# EAGLE design rapidshark-display-shifter-mk-1.1 (EAGLE 6.5.0)
AUTHOR: sean@yak.net
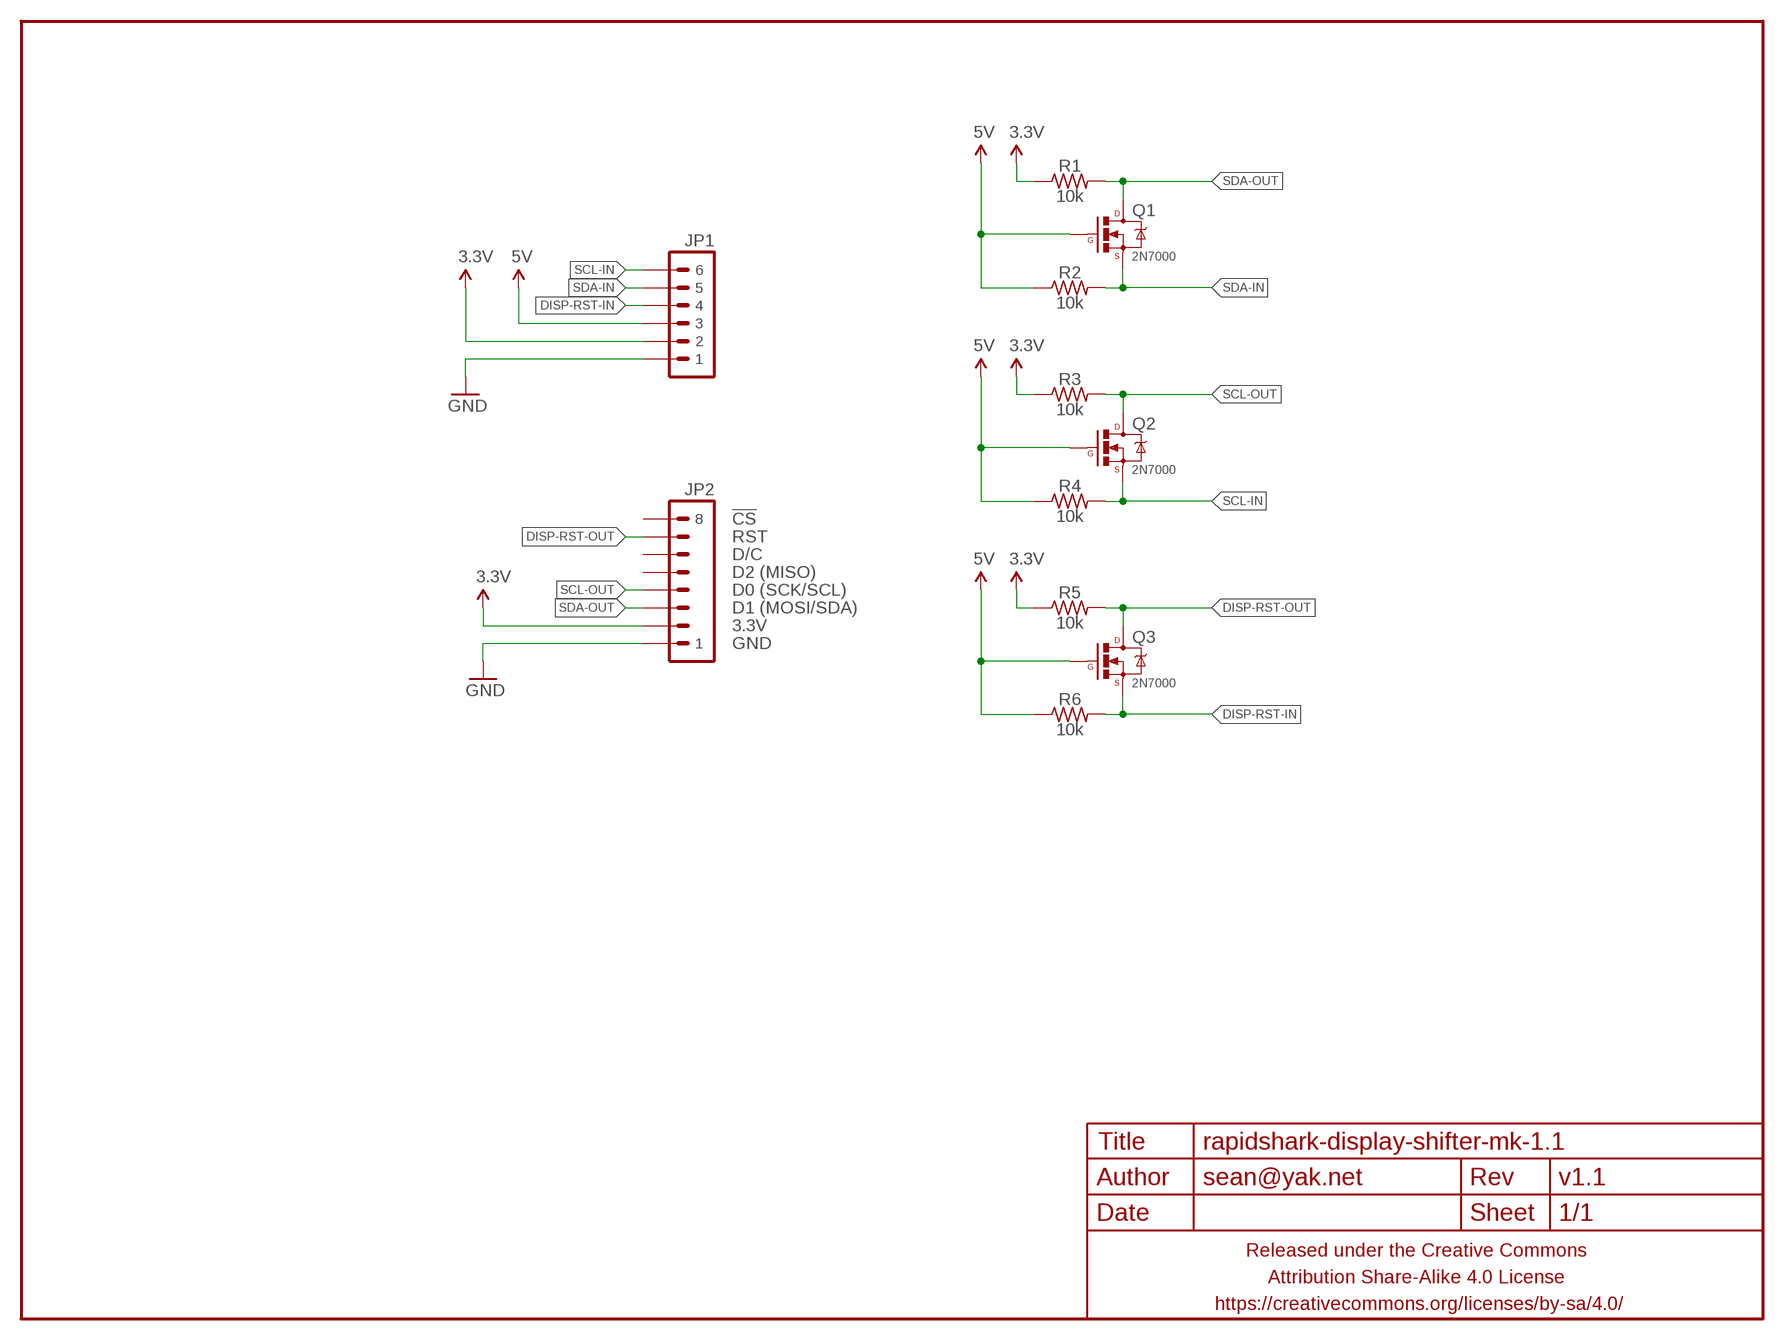
[diagram p0: schematic, sheet 1]

## Parts
FRAME1  FRAME-LETTERNO_PACKAGE  [DUMMY]
JP1  M06JST-PH-PTH-VERT  [JST-6-PH-VERT-PTH]
JP2  M081X08  [1X08]
Q1  2N7000  MOSFET-NCHANNEL2N7000-AMMO  [TO-92-AMMO]
Q2  2N7000  MOSFET-NCHANNEL2N7000-AMMO  [TO-92-AMMO]
Q3  2N7000  MOSFET-NCHANNEL2N7000-AMMO  [TO-92-AMMO]
R1  10k  RESISTORPTH-AXIAL-5.08MM  [RESISTOR-AXIAL-PTH-5.08MM]
R2  10k  RESISTORPTH-AXIAL-5.08MM  [RESISTOR-AXIAL-PTH-5.08MM]
R3  10k  RESISTORPTH-AXIAL-5.08MM  [RESISTOR-AXIAL-PTH-5.08MM]
R4  10k  RESISTORPTH-AXIAL-5.08MM  [RESISTOR-AXIAL-PTH-5.08MM]
R5  10k  RESISTORPTH-AXIAL-5.08MM  [RESISTOR-AXIAL-PTH-5.08MM]
R6  10k  RESISTORPTH-AXIAL-5.08MM  [RESISTOR-AXIAL-PTH-5.08MM]

## Nets
3.3V: JP1.2 JP2.2 R1.P$1 R3.P$1 R5.P$1
5V: JP1.3 Q1.2(G) Q2.2(G) Q3.2(G) R2.P$1 R4.P$1 R6.P$1
DISP-RST-IN: JP1.4 Q3.1(S) R6.P$2
DISP-RST-OUT: JP2.7 Q3.3(D) R5.P$2
GND: JP1.1 JP2.1
SCL-IN: JP1.6 Q2.1(S) R4.P$2
SCL-OUT: JP2.4 Q2.3(D) R3.P$2
SDA-IN: JP1.5 Q1.1(S) R2.P$2
SDA-OUT: JP2.3 Q1.3(D) R1.P$2
Unconnected: JP2.5 JP2.6 JP2.8

## Notes on the sheet
- !CS
- RST
- D/C
- D2 (MISO)
- D0 (SCK/SCL)
- D1 (MOSI/SDA)
- 3.3V
- GND

## Library data of the parts
FRAME1 = A_butts:FRAME-LETTER: Schematic Frame Standard 8.5x11 US Letter frame; DESIGNER: sean@yak.net; VERSION: v1.1
JP1 = A_butts:M06: Header 6 Standard 6-pin 0.1" header. Use with straight break away headers (SKU : PRT-00116), right angle break away headers (PRT-00553), swiss pins (PRT-00743), machine pins (PRT-00117), and female headers (PRT-00115). Molex polarized connector foot print use with SKU : PRT-08094 with associated crimp pins and housings. NOTES ON THE VARIANTS LOCK and LOCK_LONGPADS... This footprint was designed to help hold the alignment of a through-hole component (i.e. 6-pin header) while soldering it into place. You may notice that each hole has been shifted either up or down by 0.005 of an inch from it's more standard position (which is a perfectly straight line). This slight alteration caused the pins (the squares in the middle) to touch the edges of the holes. Because they are alternating, it causes a "brace" to hold the component in place. 0.005 has proven to be the perfect amount of "off-center" position when using our standard breakaway headers. Although looks a little odd when you look at the bare footprint, once you have a header in there, the alteration is very hard to notice. Also,if you push a header all the way into place, it is covered up entirely on the bottom side. This idea of altering the position of holes to aid alignment will be further integrated into the Sparkfun Library for other footprints. It can help hold any component with 3 or more connection pins.
JP2 = A_butts:M08: Header 8 Standard 8-pin 0.1" header. Use with straight break away headers (SKU : PRT-00116), right angle break away headers (PRT-00553), swiss pins (PRT-00743), machine pins (PRT-00117), and female headers (PRT-00115).
Q1-Q3 = A_butts:MOSFET-NCHANNEL: Common NMOSFET Parts MFG P/N Store ID Prod ID FDD8780 TRANS-09984 SI7820DN TRANS-11055 FDS6630A IC-08089 2N7002PW TRANS-11151 FQP30N06L COM-10213 TRANS-10060 BSS123LT1G TRANS-08345 BSS138 TRANS-00830 BS170 2N7000
R1-R6 = A_butts:RESISTOR: RESISTOR, American symbol

## Board
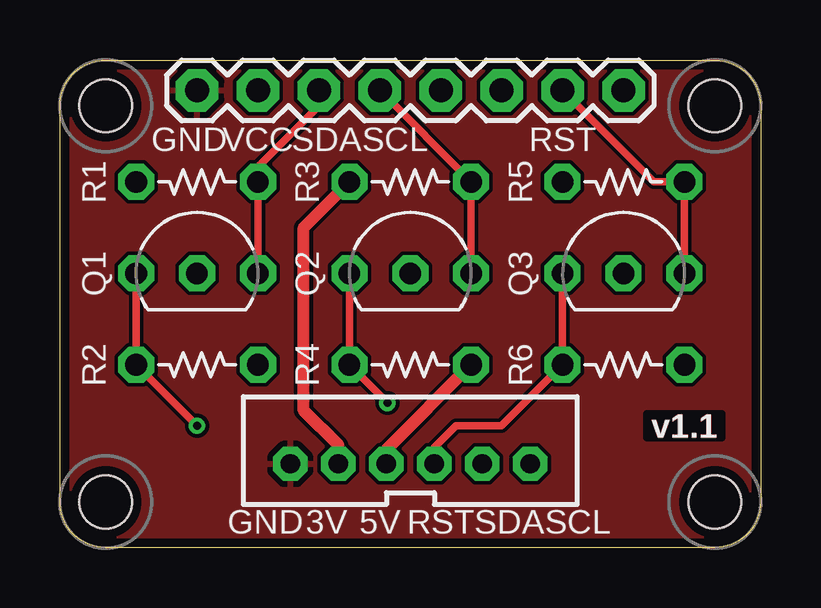
[diagram p1: board, top side]
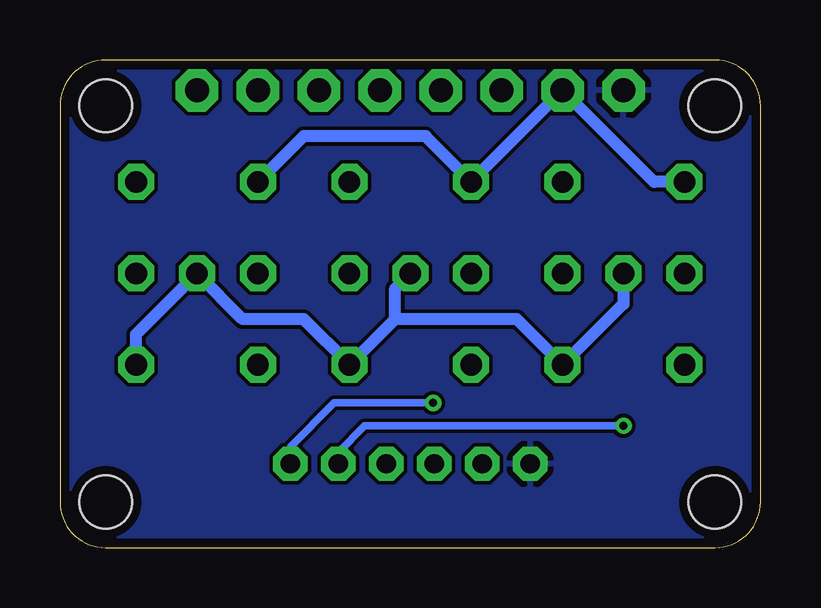
[diagram p2: board, bottom side, seen from below]

Size 29.21 x 20.32 mm. Coordinates in mm from the lower left corner, seen from the top.
Outline: 29.21,18.41 29.21,1.91 arc-90 27.3,0 1.91,0 arc-90 0,1.91 0,18.41 arc-90 1.91,20.32 27.3,20.32 arc-90 29.21,18.41
Copper layers (1*16): Top 0.0356mm / dielectric 1.5011mm / Bottom 0.0356mm
Design rules "LaenPCBOrder_2": minimum track width 6mil, minimum drill 13mil, track to track 6mil, track to pad 6mil, pad to pad 6mil, via to via 6mil, smd to smd 6mil, copper to edge 15mil, drill to drill 6mil, minimum pad ring 7mil, minimum via ring 7mil, stop-mask expansion 3mil, vias tented up to drill 20mil, thermal gap 10mil
Holes 2.2 mm at 1.91,18.41 27.3,18.41 27.3,1.91 1.91,1.91

### Footprints (pad centres in the part's own frame; a part is rotated, then mirrored left to right if it is on the bottom)
JST-6-PH-VERT-PTH = drill 0.8 pad 1.422 octagon: 1 -5,0; 2 -3,0; 3 -1,0; 4 1,0; 5 3,0; 6 5,0
1X08 = drill 1 pad 1.778 octagon: 1 0,0; 2 2.54,0; 3 5.08,0; 4 7.62,0; 5 10.16,0; 6 12.7,0; 7 15.24,0; 8 17.78,0
TO-92-AMMO = drill 0.9 pad 1.5 octagon: 1 -2.54,0; 2 0,0; 3 2.54,0
RESISTOR-AXIAL-PTH-5.08MM = drill 0.9 pad 1.5 octagon: P$1 -2.54,0; P$2 2.54,0

### Placement (x,y rotation side)
FRAME1  0,0 270 bottom
JP1  14.61,3.49 0 top
JP2  5.71,19.05 0 top
Q1  5.71,11.43 0 top
Q2  14.61,11.43 0 top
Q3  23.5,11.43 0 top
R1  5.71,15.24 0 top
R2  5.71,7.62 180 top
R3  14.61,15.24 0 top
R4  14.61,7.62 180 top
R5  23.5,15.24 0 top
R6  23.5,7.62 180 top

### Tracks (layer width: path | path; a pad name or v marks a point on that pad's centre or on a via)
3.3V
  Top 0.508: JP1.2 11.61,4.27 10.16,5.71 10.16,13.34 R3.P$1
  Bottom 0.508: R1.P$1 4.45,15.24 JP2.2 R3.P$1 13.97,17.14 19.05,17.14 R5.P$1
5V
  Top 0.508: JP1.3 13.61,4.08 R4.P$1
  Bottom 0.508: 15.24,9.53 10.16,9.53 R2.P$1 5.71,10.16 Q1.2 | 15.24,9.53 R4.P$1 19.05,9.53 21.59,9.53 Q3.2 26.04,8.89 R6.P$1 | 15.24,9.53 15.24,10.79 Q2.2
DISP-RST-IN
  Top 0.305: JP1.4 15.61,4.17 16.51,5.08 18.41,5.08 R6.P$2 Q3.1
DISP-RST-OUT
  Top 0.305: JP2.7 24.77,15.24 R5.P$2 Q3.3
GND
  pour Top (rank 6): 29.21,18.41 29.21,1.91 arc-90 27.3,0 1.91,0 arc-90 0,1.91 0,18.41 arc-90 1.91,20.32 27.3,20.32 arc-90
  pour Bottom (rank 6): 29.21,18.41 29.21,1.91 arc-90 27.3,0 1.91,0 arc-90 0,1.91 0,18.41 arc-90 1.91,20.32 27.3,20.32 arc-90
SCL-IN  (via drill 0.33)
  Top 0.305: v13.65,6.03 R4.P$2 Q2.1
  Bottom 0.305: JP1.6 19.61,4.21 17.78,6.03 v13.65,6.03
SCL-OUT
  Top 0.305: Q2.3 R3.P$2 JP2.4
SDA-IN  (via drill 0.33)
  Top 0.305: v5.71,5.08 R2.P$2 Q1.1
  Bottom 0.305: JP1.5 17.61,3.98 16.51,5.08 v5.71,5.08
SDA-OUT
  Top 0.305: Q1.3 R1.P$2 8.26,15.88 10.79,18.41 JP2.3

### Text on the board
tPlace: GND | VCC | SDA | SCL | RST | GND | 3V | 5V | RST | SDA | SCL